# EAGLE design PGTN034_quantizer_mki_panel (EAGLE 9.6.0)
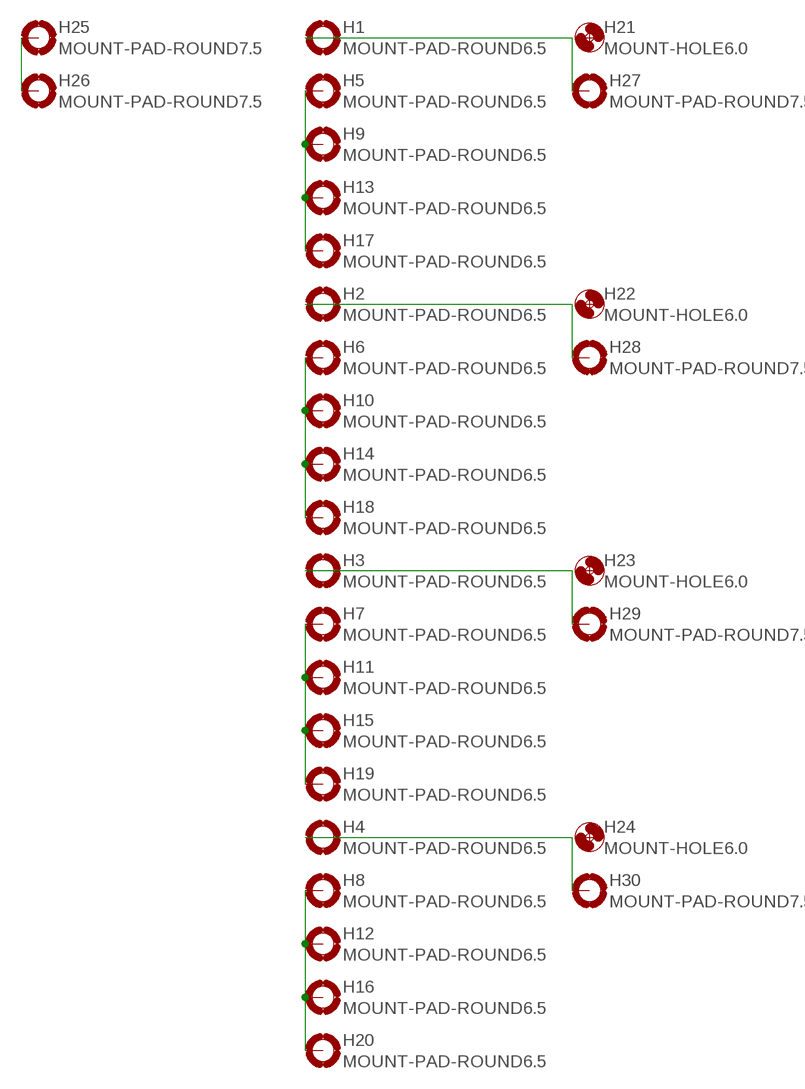
[diagram p0: schematic, sheet 1]

## Parts
H1  MOUNT-PAD-ROUND6.5  [6.5-PAD]
H2  MOUNT-PAD-ROUND6.5  [6.5-PAD]
H3  MOUNT-PAD-ROUND6.5  [6.5-PAD]
H4  MOUNT-PAD-ROUND6.5  [6.5-PAD]
H5  MOUNT-PAD-ROUND6.5  [6.5-PAD]
H6  MOUNT-PAD-ROUND6.5  [6.5-PAD]
H7  MOUNT-PAD-ROUND6.5  [6.5-PAD]
H8  MOUNT-PAD-ROUND6.5  [6.5-PAD]
H9  MOUNT-PAD-ROUND6.5  [6.5-PAD]
H10  MOUNT-PAD-ROUND6.5  [6.5-PAD]
H11  MOUNT-PAD-ROUND6.5  [6.5-PAD]
H12  MOUNT-PAD-ROUND6.5  [6.5-PAD]
H13  MOUNT-PAD-ROUND6.5  [6.5-PAD]
H14  MOUNT-PAD-ROUND6.5  [6.5-PAD]
H15  MOUNT-PAD-ROUND6.5  [6.5-PAD]
H16  MOUNT-PAD-ROUND6.5  [6.5-PAD]
H17  MOUNT-PAD-ROUND6.5  [6.5-PAD]
H18  MOUNT-PAD-ROUND6.5  [6.5-PAD]
H19  MOUNT-PAD-ROUND6.5  [6.5-PAD]
H20  MOUNT-PAD-ROUND6.5  [6.5-PAD]
H21  MOUNT-HOLE6.0  [6,0]
H22  MOUNT-HOLE6.0  [6,0]
H23  MOUNT-HOLE6.0  [6,0]
H24  MOUNT-HOLE6.0  [6,0]
H25  MOUNT-PAD-ROUND7.5  [7.5-PAD]
H26  MOUNT-PAD-ROUND7.5  [7.5-PAD]
H27  MOUNT-PAD-ROUND7.5  [7.5-PAD]
H28  MOUNT-PAD-ROUND7.5  [7.5-PAD]
H29  MOUNT-PAD-ROUND7.5  [7.5-PAD]
H30  MOUNT-PAD-ROUND7.5  [7.5-PAD]

## Nets
N$1: H5.B6.5(MOUNT) H9.B6.5(MOUNT) H13.B6.5(MOUNT) H17.B6.5(MOUNT)
N$2: H6.B6.5(MOUNT) H10.B6.5(MOUNT) H14.B6.5(MOUNT) H18.B6.5(MOUNT)
N$3: H7.B6.5(MOUNT) H11.B6.5(MOUNT) H15.B6.5(MOUNT) H19.B6.5(MOUNT)
N$4: H8.B6.5(MOUNT) H12.B6.5(MOUNT) H16.B6.5(MOUNT) H20.B6.5(MOUNT)
N$5: H2.B6.5(MOUNT) H28.B7.5(MOUNT)
N$6: H3.B6.5(MOUNT) H29.B7.5(MOUNT)
N$7: H4.B6.5(MOUNT) H30.B7.5(MOUNT)
N$8: H25.B7.5(MOUNT) H26.B7.5(MOUNT)
N$9: H1.B6.5(MOUNT) H27.B7.5(MOUNT)

## Library data of the parts
H1-H20 H25-H30 = holes:MOUNT-PAD-ROUND: MOUNTING PAD, round
H21-H24 = holes:MOUNT-HOLE: MOUNTING HOLE with drill center marker

## Board
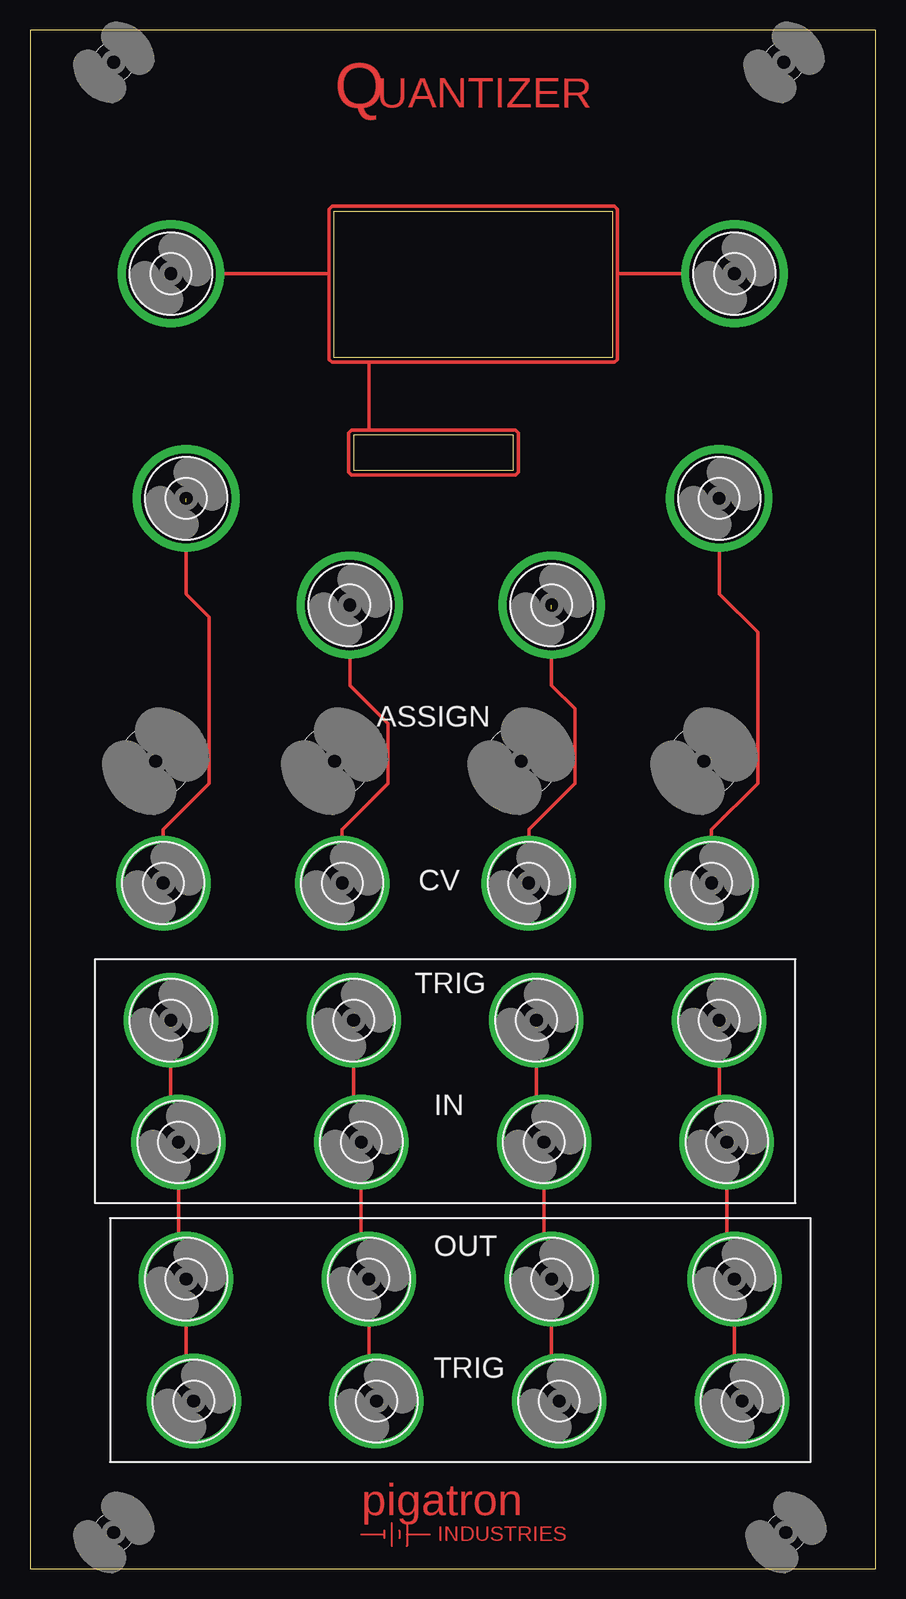
[diagram p1: board, top side]

Size 70.54 x 128.26 mm. Coordinates in mm from the lower left corner, seen from the top.
Outline: 0,0 70.54,0 70.54,128.26 0,128.26 0,0
Outline: 25.34,113.16 48.58,113.16 48.58,100.97 25.34,100.97 25.34,113.16
Outline: 26.99,91.57 40.32,91.57 40.32,94.49 26.99,94.49 26.99,91.57
Copper layers (1*16): Top 0.0356mm / dielectric 1.5011mm / Bottom 0.0356mm
Design rules "pigatron *": minimum track width 8mil, minimum drill 13mil, track to track 8mil, track to pad 8mil, pad to pad 8mil, via to via 8mil, smd to smd 6mil, copper to edge 10mil, drill to drill 10mil, minimum pad ring 6mil, minimum via ring 10mil, stop-mask expansion 4mil, vias tented up to drill 15mil, thermal gap 10mil

### Footprints (pad centres in the part's own frame; a part is rotated, then mirrored left to right if it is on the bottom)
6.5-PAD = drill 6.502 pad 7.874: B6.5 0,0
6,0 = hole 6: 0,0
7.5-PAD = drill 7.493 pad 8.89: B7.5 0,0
3,3 = hole 3.3: 0,0

### Placement (x,y rotation side)
H1  11.11,57.15 0 top
H2  26.04,57.15 0 top
H3  41.59,57.15 0 top
H4  56.83,57.15 0 top
H5  11.75,45.72 0 top
H6  26.99,45.72 0 top
H7  42.23,45.72 0 top
H8  57.47,45.72 0 top
H9  12.38,35.56 0 top
H10  27.62,35.56 0 top
H11  42.86,35.56 0 top
H12  58.1,35.56 0 top
H13  13.02,24.13 0 top
H14  28.26,24.13 0 top
H15  43.5,24.13 0 top
H16  58.74,24.13 0 top
H17  13.65,13.97 0 top
H18  28.89,13.97 0 top
H19  44.13,13.97 0 top
H20  59.37,13.97 0 top
H21  10.48,67.31 0 top
H22  25.4,67.31 0 top
H23  40.96,67.31 0 top
H24  56.2,67.31 0 top
H25  11.75,107.95 0 top
H26  58.74,107.95 0 top
H27  13.02,89.22 0 top
H28  26.67,80.33 0 top
H29  43.5,80.33 0 top
H30  57.47,89.22 0 top
U$2  [PIGATRON-LOGO-TRACE]  36.51,4.45 0 top
U$3  [3,3]  6.99,125.57 0 top
U$4  [3,3]  62.87,125.57 0 top
U$5  [3,3]  6.99,3.02 0 top
U$6  [3,3]  63.02,3.02 0 top

### Tracks (layer width: path | path; a pad name or v marks a point on that pad's centre or on a via)
N$1
  Top 0.305: 11.11,46.36 H5.B6.5 11.75,36.2 H9.B6.5 12.38,24.77 H13.B6.5 13.02,14.61 H17.B6.5
N$2
  Top 0.305: 26.04,46.67 H6.B6.5 26.99,36.2 H10.B6.5 27.62,24.77 H14.B6.5 28.26,14.61 H18.B6.5
N$3
  Top 0.305: 41.59,46.36 H7.B6.5 42.23,36.2 H11.B6.5 42.86,24.77 H15.B6.5 43.5,14.61 H19.B6.5
N$4
  Top 0.305: 56.83,46.36 H8.B6.5 57.47,36.2 H12.B6.5 58.1,24.77 H16.B6.5 58.74,14.61 H20.B6.5
N$5
  Top 0.305: H2.B6.5 26.04,61.62 29.87,65.46 29.87,70.43 26.67,73.63 H28.B7.5
N$6  (1 unrouted)
  Top 0.305: H3.B6.5 41.59,61.62 45.43,65.46 45.43,71.7 43.5,73.63 43.5,80.01
N$7
  Top 0.305: H4.B6.5 56.83,61.59 60.67,65.43 60.67,78.05 57.47,81.25 H30.B7.5
N$8
  Top 0.305: 24.93,107.95 H25.B7.5 | 24.93,107.95 24.93,100.8 25.17,100.56 28.26,100.56 | H26.B7.5 48.98,107.95 | 28.26,100.56 48.75,100.56 48.98,100.8 48.98,107.95 | 48.98,107.95 48.98,113.33 48.75,113.56 25.17,113.56 24.93,113.33 24.93,107.95 | 28.26,94.93 28.26,94.89 40.49,94.89 40.73,94.66 40.73,91.4 40.49,91.16 26.82,91.16 26.58,91.4 26.58,94.66 26.82,94.89 28.22,94.89 28.26,94.93 | 28.26,100.56 28.26,94.93
N$9  (1 unrouted)
  Top 0.305: H1.B6.5 11.11,61.62 14.95,65.46 14.95,79.32 13.02,81.25 13.02,88.9

### Text on the board
Top: Q | UANTIZER
tNames: ASSIGN | CV | TRIG | IN | OUT | TRIG
bNames: Rob Ellis 2022
bValues: 74AHCT1G125
tStop: Q | UANTIZER